# EAGLE design Trinkey-TriSwitch (EAGLE 9.6.2)
AUTHOR: ladyada
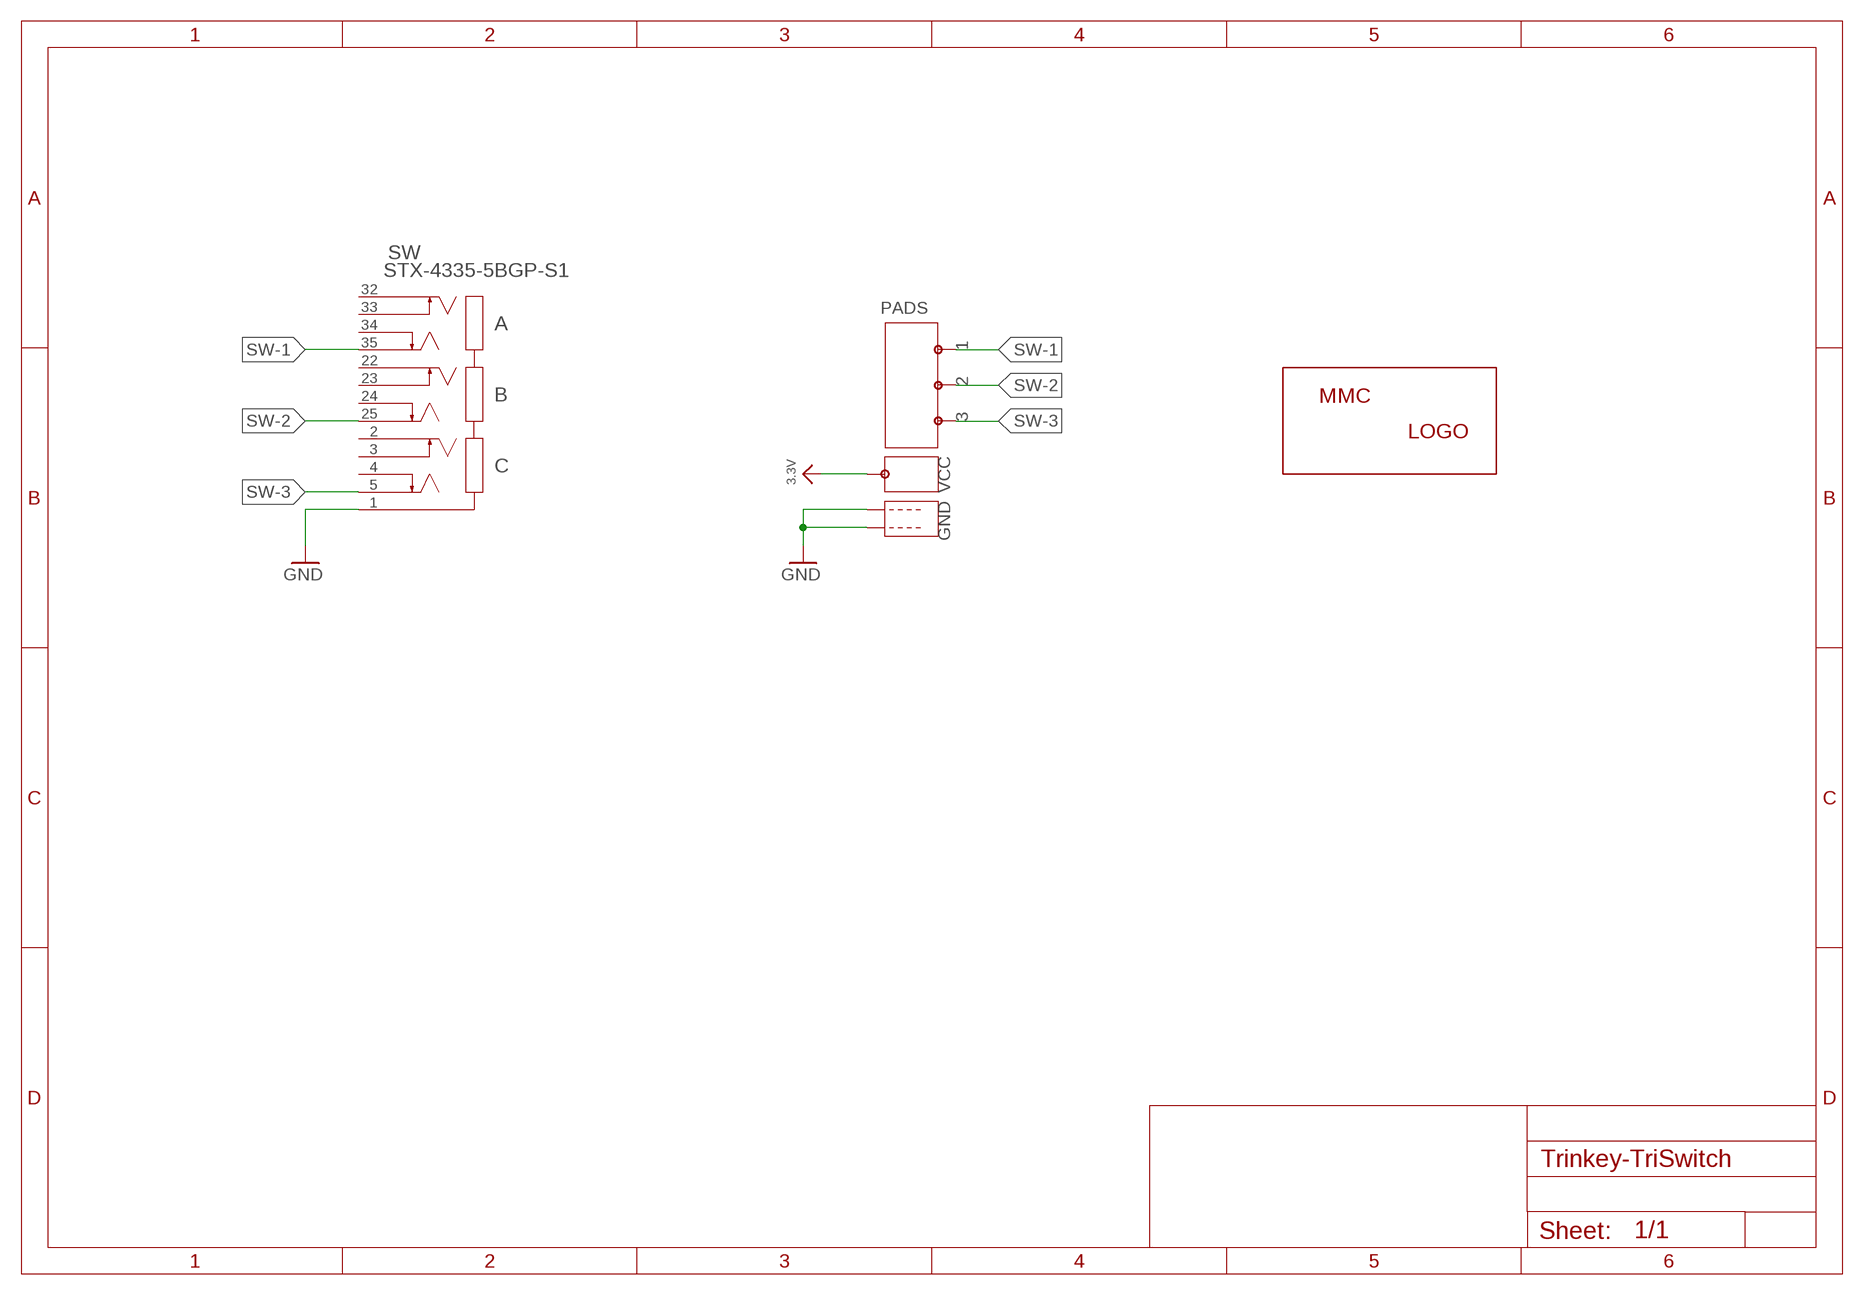
[diagram p0: schematic, sheet 1]

## Parts
LABEL_LOGO  MMC_LOGO-XSM  [MMC_X-SMALL_LOGO]
PADS  CASTELLATED-ROTARY-TRINKEY  [CASTELLATED-ROTARY-TRINKEY]
SW  STX-4335-5BGP-S1  [STX-4335-5BGP-S1_KYC]

## Nets
3.3V: PADS.P$VCC
GND: PADS.P$GND1 PADS.P$GND2 SW.1
SW-1: PADS.P$S1 SW.35
SW-2: PADS.P$S2 SW.25
SW-3: PADS.P$S3 SW.5
Unconnected: SW.2 SW.3 SW.4 SW.22 SW.23 SW.24 SW.32 SW.33 SW.34

## Library data of the parts
LABEL_LOGO = MMC Eagle:MMC_LOGO-
PADS = MMC Eagle:CASTELLATED-ROTARY-TRINKEY: Rotary Encoder with Built-In Switch PEC11 - 24 Step, PEC11-4215F-S24 - http://www.adafruit.com/products/377
SW = MMC Eagle:STX-4335-5BGP-S1; COPYRIGHT: Copyright (C) 2022 Ultra Librarian. All rights reserved.; DIGI-KEY_PART_NUMBER_1: 2092-STX-4335-5BGP-S1-ND; MANUFACTURER_PART_NUMBER: STX-4335-5BGP-S1; MFR_NAME: KYCON, INC.

## Board
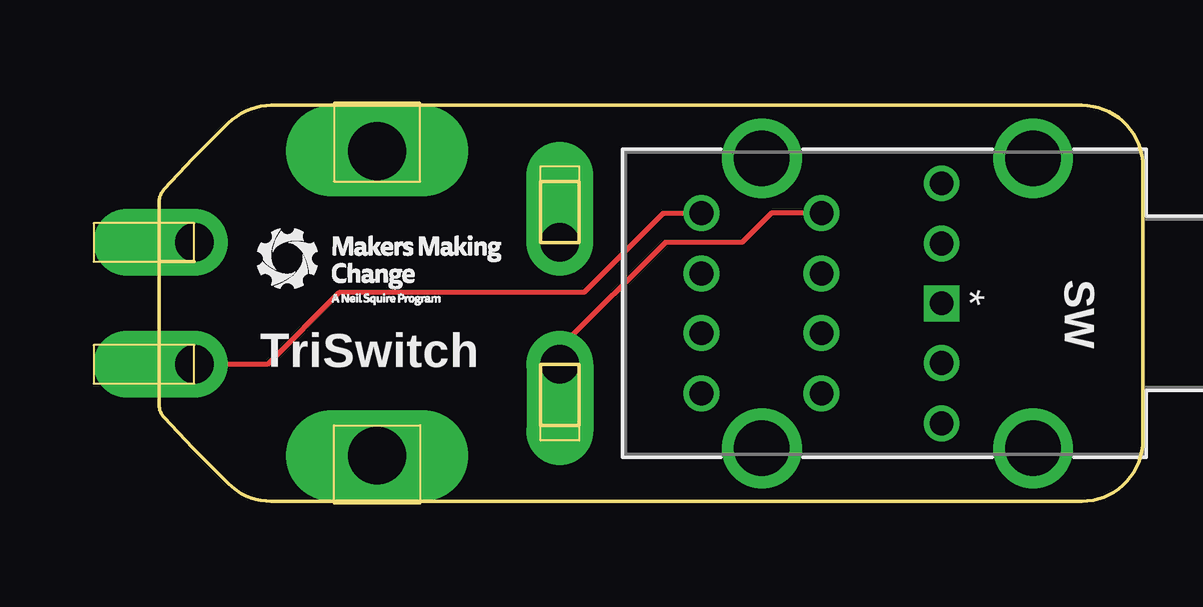
[diagram p1: board, top side]
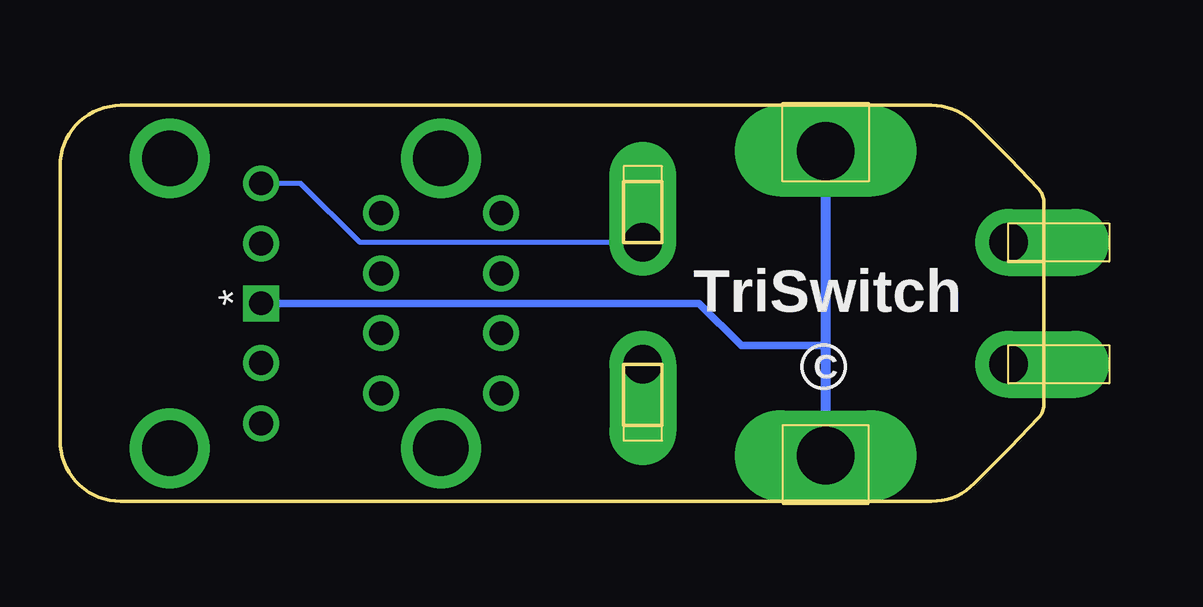
[diagram p2: board, bottom side, seen from below]

Size 41 x 16.51 mm. Coordinates in mm from the lower left corner, seen from the top.
Outline: 0,9.99 1.46,9.99
Outline: 0.2,13.02 1.4,14.29 2.88,15.77 arc-45 4.67,16.51 38.46,16.51 arc-90 41,13.97 41,2.54 arc-90 38.46,0 4.67,0 arc-45 2.88,0.74 1.4,2.22 0.2,3.49 arc-35 0,3.94 0,12.57 arc-35 0.2,13.02
Outline: 15.9,3.17 15.9,5.71 17.5,5.71 17.5,3.17 15.9,3.17
Outline: 15.9,10.79 15.9,13.34 17.5,13.34 17.5,10.79 15.9,10.79
Copper layers (1*16): Top 0.035mm / dielectric 1.5mm / Bottom 0.035mm
Design rules "adafruit 8-8 *": minimum track width 8mil, minimum drill 15.5mil, track to track 8mil, track to pad 8mil, pad to pad 8mil, via to via 8mil, smd to smd 8mil, copper to edge 10mil, drill to drill 8mil, minimum pad ring 10mil, minimum via ring 8mil, stop-mask expansion 2mil, vias tented up to drill 20mil, thermal gap 10mil

### Footprints (pad centres in the part's own frame; a part is rotated, then mirrored left to right if it is on the bottom)
CASTELLATED-ROTARY-TRINKEY = drill 2.4 pad 3.8 long: P$GND1 -6.35,0; P$GND2 6.35,0 | drill 1.6 pad 2.8 offset: P$S1 2.54,7.62; P$S2 2.54,-7.62; P$S3 -2.54,-7.62; P$VCC -2.54,7.62
STX-4335-5BGP-S1_KYC = drill 0.991 pad 1.499 square: 1 0,0 | drill 0.991 pad 1.499: 2 5.004,0; 3 2.489,0; 4 -2.489,0; 5 -5.004,0; 22 3.759,-5.004; 23 1.245,-5.004; 24 -1.245,-5.004; 25 -3.759,-5.004; 32 3.759,-10.008; 33 1.245,-10.008; 34 -1.245,-10.008; 35 -3.759,-10.008 | drill 2.311 pad 2.819: M1 -6.045,3.81; M2 6.045,3.81; M3 -6.045,-7.493; M4 6.045,-7.493

### Placement (x,y rotation side)
LABEL_LOGO  9.08,8.2 0 top
PADS  9.08,8.26 270 bottom
SW  32.61,8.26 270 top

### Tracks (layer width: path | path; a pad name or v marks a point on that pad's centre or on a via)
GND
  Bottom 0.305: SW.1 14.36,8.26 12.6,6.5 9.08,6.5
  Bottom 0.406: PADS.P$GND1 9.08,6.5 PADS.P$GND2
SW-1
  Top 0.203: PADS.P$S1 4.51,5.71 7.52,8.72 17.72,8.72 21.01,12.01 SW.35
SW-2
  Top 0.203: SW.25 25.51,12.01 24.3,10.8 21.1,10.8 16.75,6.45 16.7,6.4 PADS.P$S2
SW-3
  Bottom 0.203: PADS.P$S3 28.5,10.79 30.96,13.26 SW.5

### Text on the board
tPlace: TriSwitch
bPlace: TriSwitch | C